# EAGLE design GPduino (EAGLE 6.5.0)
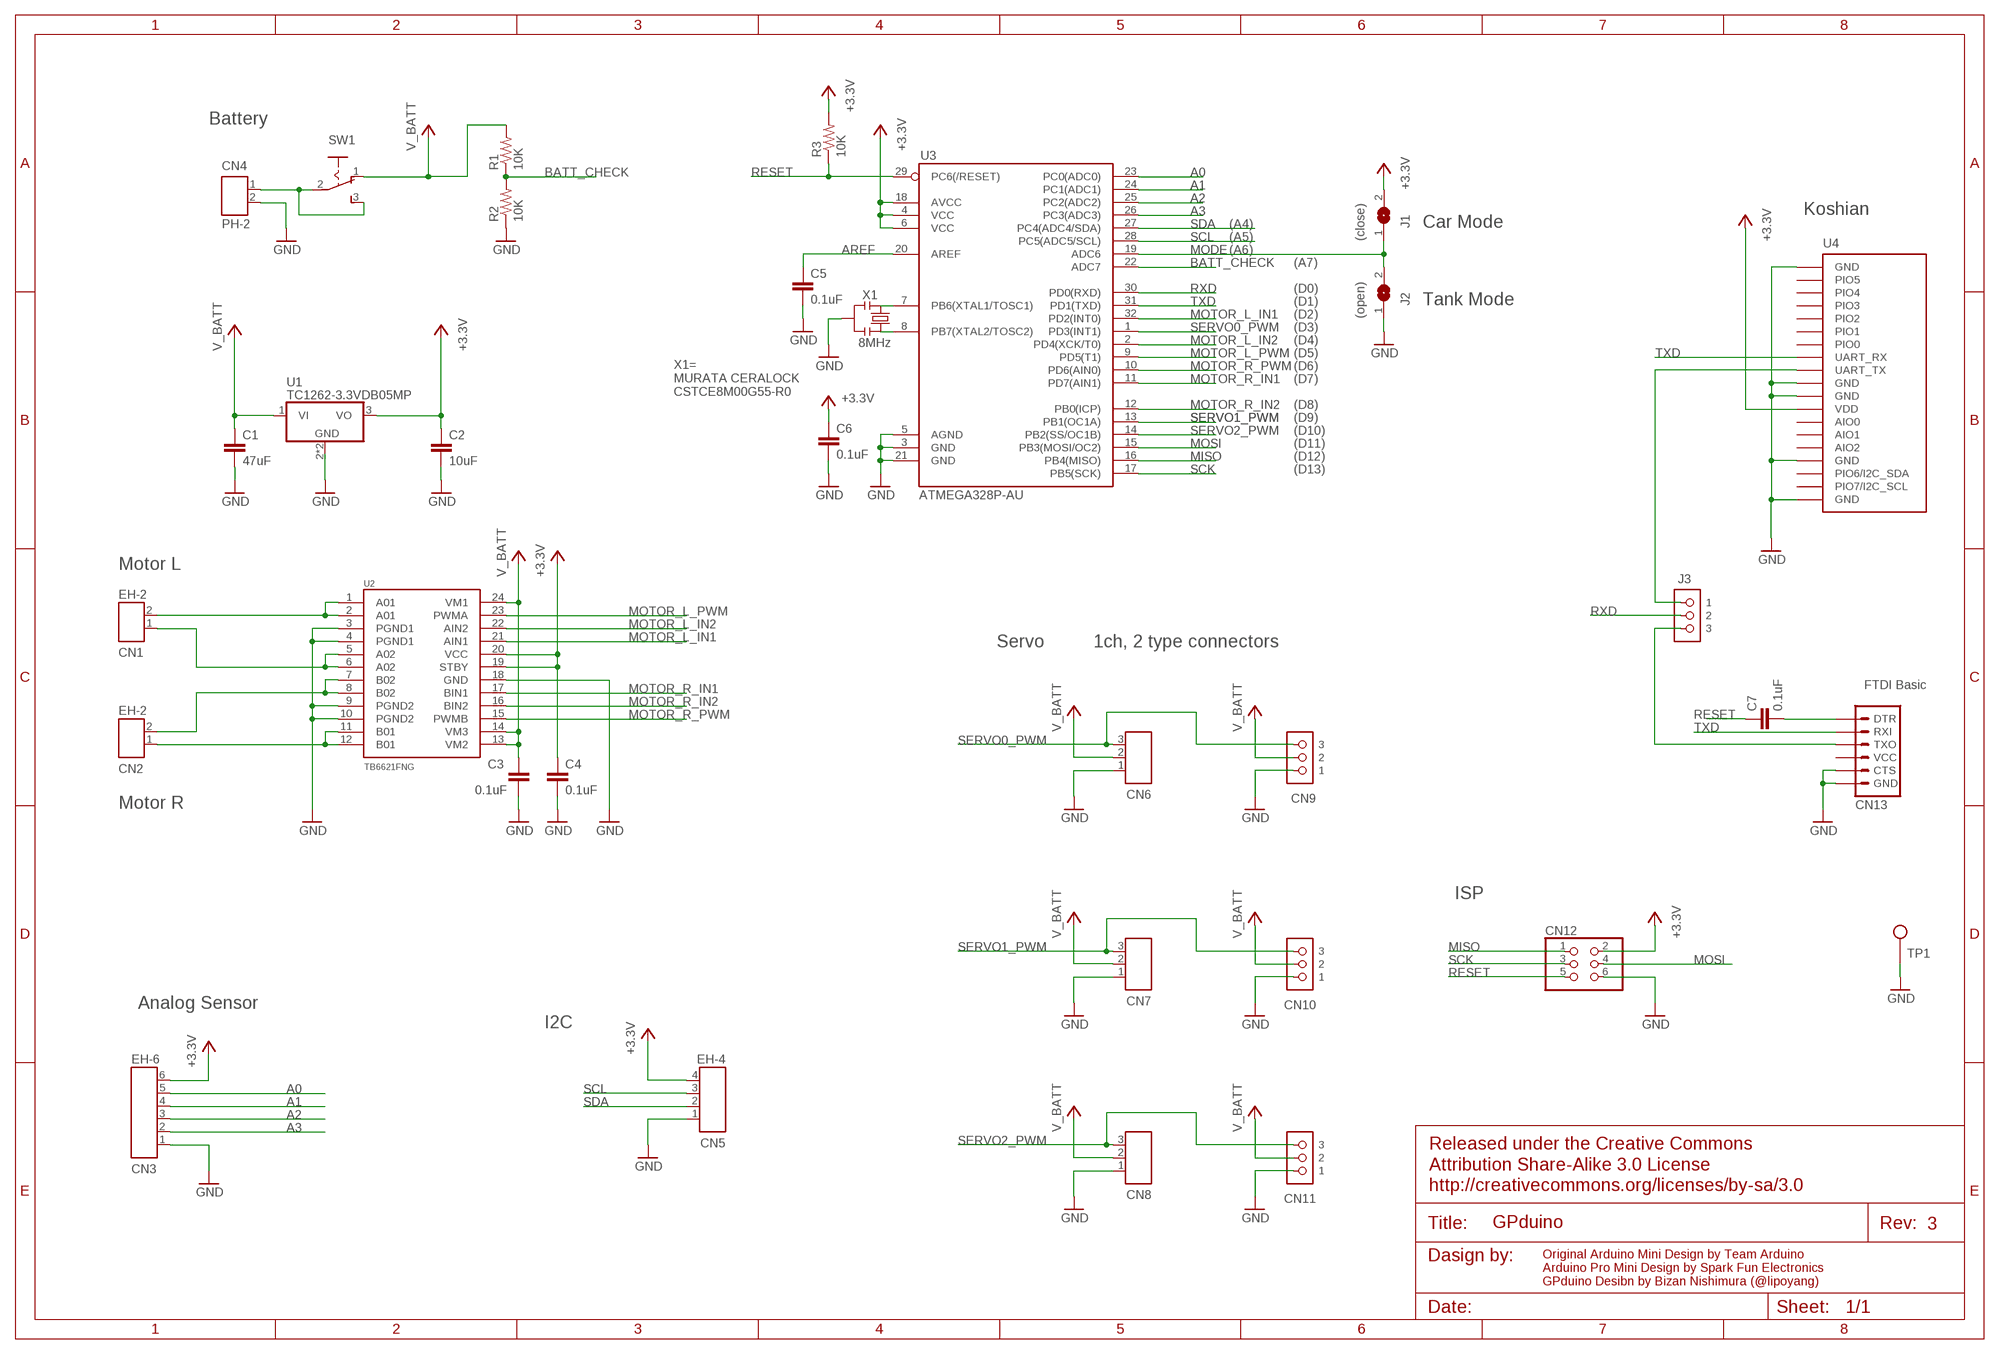
[diagram p0: schematic, sheet 1]

## Parts
C1  47uF  C-EUC3216  [C3216]
C2  10uF  C-EUC3216  [C3216]
C3  0.1uF  C-EUC1608  [C1608]
C4  0.1uF  C-EUC1608  [C1608]
C5  0.1uF  C-EUC1608  [C1608]
C6  0.1uF  C-EUC1608  [C1608]
C7  0.1uF  C-EUC1608  [C1608]
CN1  EH-2  [EH-2]
CN2  EH-2  [EH-2]
CN3  EH-6  [EH-6]
CN4  PH-2  [PH-2]
CN5  EH-4  [EH-4]
CN6  PICOBLADE-3  [PICOBLADE-3]
CN7  PICOBLADE-3  [PICOBLADE-3]
CN8  PICOBLADE-3  [PICOBLADE-3]
CN9  cn6  PINHD-1X3  [CON_RC_SERVO]
CN10  cn6  PINHD-1X3  [CON_RC_SERVO]
CN11  cn6  PINHD-1X3  [CON_RC_SERVO]
CN12  CN9  PINHD-2X3  [2X03]
CN13  FTDI Basic  ARDUINO_SERIAL_PROGRAMPTH  [1X06]
J1  (close)  SJ  [SJ]
J2  (open)  SJ  [SJ]
J3  XX-2  JUMPER_PIN_1X3  [JUMPER_PIN_1X3]
R1  10K  RESISTOR0603-RES  [0603-RES]
R2  10K  RESISTOR0603-RES  [0603-RES]
R3  10K  RESISTOR0603-RES  [0603-RES]
SW1  SW1  M251  [SLIDE-SW]
TP1  TEST_PIN  [TEST_PIN]
U1  TC1262-3.3VDB05MP  [SOT223]
U2  TB6621FNG  [SSOP24]
U3  ATMEGA328P-AU  ATMEGA168  [TQFP32-08]
U4  KOSHIAN  [KOSHIAN]
X1  8MHz  RESONATOR1:1  [RESONATOR-SMD-1:1]

## Nets
+3V3: C2.1 C4.1 C6.1 CN3.6 CN5.4 CN12.2 J1.2 R3.2 U1.3(VO) U2.19(STBY) U2.20(VCC) U3.4(VCC) U3.6(VCC) U3.18(AVCC) U4.12(VDD) ; supply symbol labelled +3.3V
A0: CN3.5 U3.23(PC0(ADC0))
A01: CN1.2 U2.1(A01) U2.2(A01)
A1: CN3.4 U3.24(PC1(ADC1))
A02: CN1.1 U2.5(A02) U2.6(A02)
A2: CN3.3 U3.25(PC2(ADC2))
A3: CN3.2 U3.26(PC3(ADC3))
AREF: C5.1 U3.20(AREF)
BATT_CHECK: R1.1 R2.2 U3.22(ADC7)
GND: C1.2 C2.2 C3.2 C4.2 C5.2 C6.2 CN3.1 CN4.2 CN5.1 CN6.1 CN7.1 CN8.1 CN9.1 CN10.1 CN11.1 CN12.6 CN13.5(CTS) CN13.6(GND) J2.1 R2.1 TP1.1 U1.2(GND) U1.4(GND) U2.3(PGND1) U2.4(PGND1) U2.9(PGND2) U2.10(PGND2) U2.18(GND) U3.3(GND) U3.5(AGND) U3.21(GND) U4.1(GND) U4.10(GND) U4.11(GND) U4.16(GND) U4.16@2(GND) U4.20(GND) X1.2
MISO: CN12.1 U3.16(PB4(MISO))
MODE: J1.1 J2.2 U3.19(ADC6)
MOSI: CN12.4 U3.15(PB3(MOSI/OC2))
MOTOR_L_IN1: U2.21(AIN1) U3.32(PD2(INT0))
MOTOR_L_IN2: U2.22(AIN2) U3.2(PD4(XCK/T0))
MOTOR_L_PWM: U2.23(PWMA) U3.9(PD5(T1))
MOTOR_R_IN1: U2.17(BIN1) U3.11(PD7(AIN1))
MOTOR_R_IN2: U2.16(BIN2) U3.12(PB0(ICP))
MOTOR_R_PWM: U2.15(PWMB) U3.10(PD6(AIN0))
N$1: CN4.1 SW1.2(P) SW1.3(S)
N$3: U3.8(PB7(XTAL2/TOSC2)) X1.3
N$4: U3.7(PB6(XTAL1/TOSC1)) X1.1
N$5: CN2.1 U2.11(B01) U2.12(B01)
N$6: CN2.2 U2.7(B02) U2.8(B02)
N$11: J3.1 U4.9(UART_TX)
N$12: C7.2 CN13.1(DTR)
N$15: CN13.3(TXO) J3.3
RESET: C7.1 CN12.5 R3.1 U3.29(PC6(/RESET))
RXD: J3.2 U3.30(PD0(RXD))
SCK: CN12.3 U3.17(PB5(SCK))
SCL: CN5.3 U3.28(PC5(ADC5/SCL))
SDA: CN5.2 U3.27(PC4(ADC4/SDA))
SERVO0_PWM: CN6.3 CN9.3 U3.1(PD3(INT1))
SERVO1_PWM: CN7.3 CN10.3 U3.13(PB1(OC1A))
SERVO2_PWM: CN8.3 CN11.3 U3.14(PB2(SS/OC1B))
TXD: CN13.2(RXI) U3.31(PD1(TXD)) U4.8(UART_RX) U4.8@2(UART_RX)
V_BATT: C1.1 C3.1 CN6.2 CN7.2 CN8.2 CN9.2 CN10.2 CN11.2 R1.2 SW1.1(O) U1.1(VI) U2.13(VM2) U2.14(VM3) U2.24(VM1)
Unconnected: CN13.4(VCC) U4.2(PIO5) U4.3(PIO4) U4.4(PIO3) U4.5(PIO2) U4.6(PIO1) U4.7(PIO0) U4.13(AIO0) U4.14(AIO1) U4.15(AIO2) U4.17(PIO6/I2C_SDA) U4.18(PIO7/I2C_SCL)

## Notes on the sheet
- Battery
- Koshian
- (A4) | Car Mode
- (A5)
- (A6)
- (A7)
- (D0)
- (D1) | Tank Mode
- (D2)
- (D3)
- (D4)
- (D5)
- (D6)
- (D7)
- X1=
  MURATA CERALOCK
  CSTCE8M00G55-R0
- (D8)
- (D9)
- (D10)
- (D11)
- (D12)
- (D13)
- Motor L
- Servo | 1ch, 2 type connectors
- Motor R
- ISP
- Analog Sensor
- I2C
- 3
- Original Arduino Mini Design by Team Arduino
  Arduino Pro Mini Design by Spark Fun Electronics
  GPduino Desibn by Bizan Nishimura (@lipoyang)

## Library data of the parts
C1-C7 = resistor:C-EU: CAPACITOR, European symbol
CN1 CN2 = lipoyang_mechanical:EH-2
CN3 = lipoyang_mechanical:EH-6
CN4 = lipoyang_mechanical:PH-2
CN5 = lipoyang_mechanical:EH-4
CN6-CN8 = lipoyang_mechanical:PICOBLADE-3
CN9-CN11 = lipoyang_mechanical:PINHD-1X3: PIN HEADER
CN12 = lipoyang_mechanical:PINHD-2X3: PIN HEADER
CN13 = SparkFun:ARDUINO_SERIAL_PROGRAM
J1 J2 = lipoyang:SJ: SMD solder JUMPER
J3 = lipoyang_mechanical:JUMPER_PIN_1X3: JUMPER
R1-R3 = SparkFun:RESISTOR: Resistor Basic schematic elements and footprints for 0603, 1206, and PTH resistors.
SW1 = pendolino:M251: SLIDING SWITCH Mors, distributor Buerklin, 11G702
TP1 = lipoyang:TEST_PIN: Test Pin
U1 = lipoyang:TC1262-3.3VDB: Positive VOLTAGE REGULATOR Source: http://cache.national.com/ds/LM/LM340.pdf
U2 = SparkFun:TB6621FNG: Toshiba 1A motor driver
U3 = SparkFun:ATMEGA168
U4 = lipoyang_rf:KOSHIAN
X1 = Testing:RESONATOR: Resonator Small SMD resonator. This is the itty bitty 10/20MHz resonators with built in caps. CSTCE10M0G55 and CSTCE20M0V53. Footprint for SMD has been used in SFE production for years, and does work okay. 1:1 is an attempt to get larger fillets on the sides so it will be easier to inspect these solders in our AOI machine. The pads have been minimized to match the actual metal under the resonator. To see this relation, it includes an image import of the bottom side of the component. Imported to scale on layer 200.

## Net classes
0 default: width 0.203 mm
1 vcc: width 0.254 mm

## Board
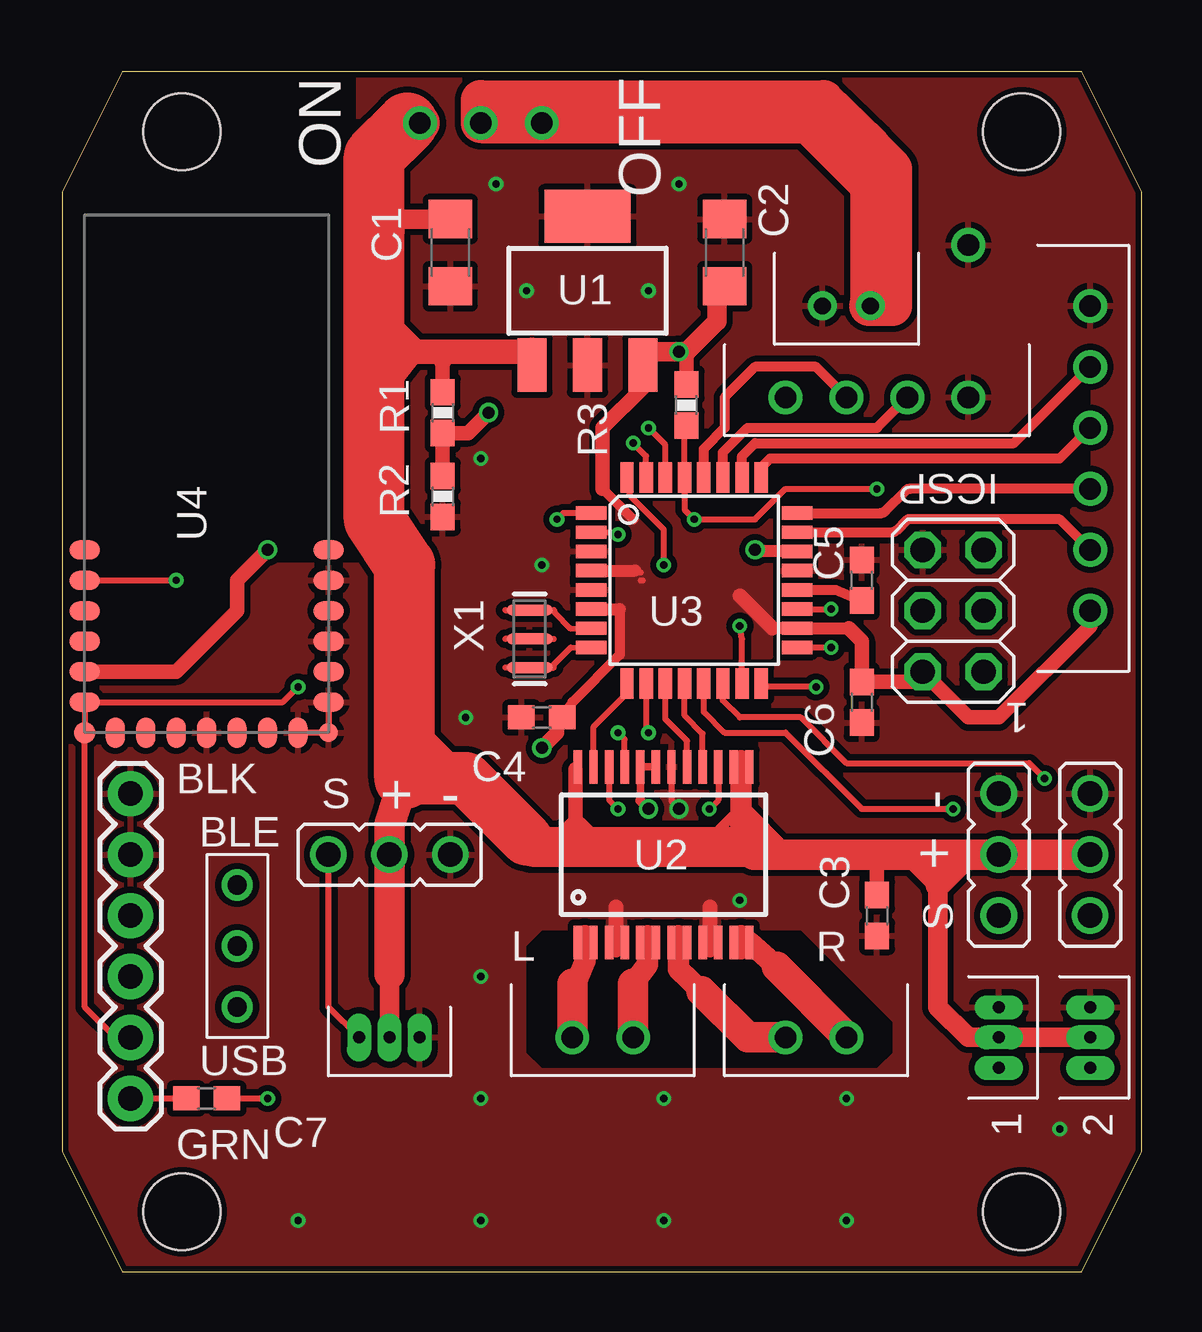
[diagram p1: board, top side]
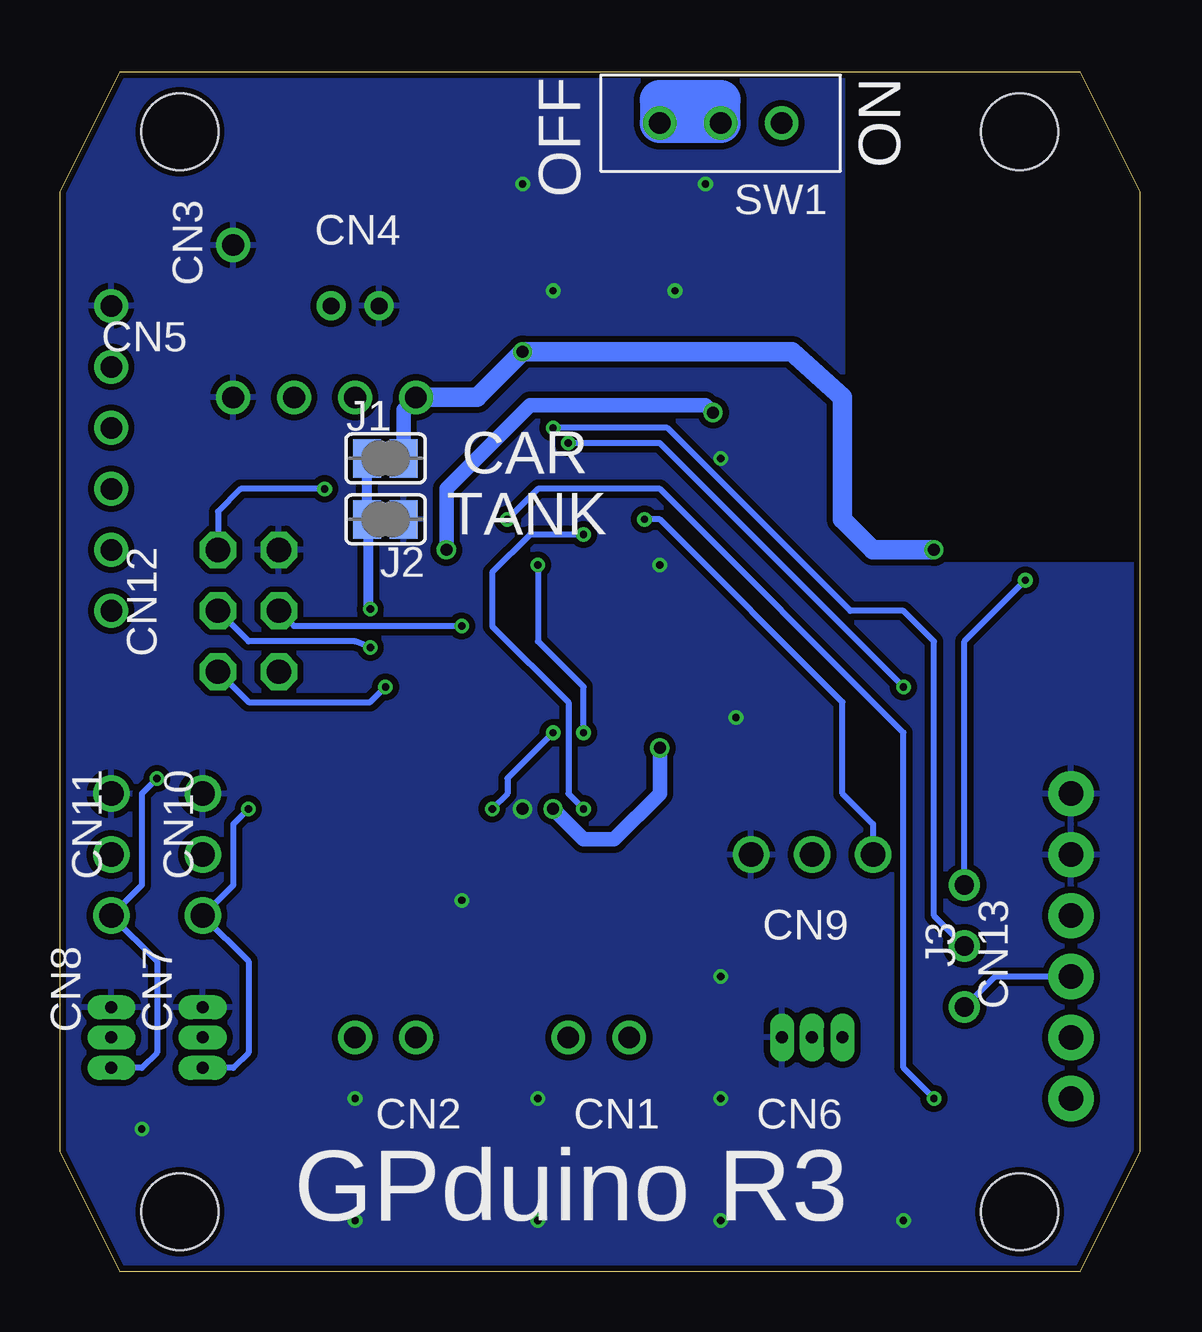
[diagram p2: board, bottom side, seen from below]

Size 45 x 50 mm. Coordinates in mm from the lower left corner, seen from the top.
Outline: 2.5,0 42.5,0 45,5 45,45 42.5,50 2.5,50 0,45 0,5 2.5,0
Copper layers (1*16): Top 0.035mm / dielectric 1.5mm / Bottom 0.035mm
Design rules "SeeedStudio_2layer_DRU_no_angle_20140221_lipoyang": minimum track width 8mil, minimum drill 12mil, track to track 8mil, track to pad 8mil, pad to pad 8mil, via to via 8mil, smd to smd 0mil, copper to edge 10mil, drill to drill 10mil, minimum pad ring 10mil, minimum via ring 6mil, stop-mask expansion 2mil, vias tented up to drill 100mil, thermal gap 10mil
Holes 3.2 mm at 5,47.5 40,47.5 5,2.5 40,2.5

### Footprints (pad centres in the part's own frame; a part is rotated, then mirrored left to right if it is on the bottom)
C3216 = smd 1.6 x 1.8: 1 -1.4,0; 2 1.4,0
C1608 = smd 1.1 x 1: 1 -0.85,0; 2 0.85,0
EH-2 = drill 0.9: 1 -1.27,0; 2 1.27,0
EH-6 = drill 0.9: 1 -6.35,0; 2 -3.81,0; 3 -1.27,0; 4 1.27,0; 5 3.81,0; 6 6.35,0
PH-2 = drill 0.7: 1 -1,0; 2 1,0
EH-4 = drill 0.9: 1 -3.81,0; 2 -1.27,0; 3 1.27,0; 4 3.81,0
PICOBLADE-3 = drill 0.5 long: 1 -1.25,0; 2 0,0; 3 1.27,0
CON_RC_SERVO = drill 1.016: 1 -2.54,0; 2 0,0; 3 2.54,0
2X03 = drill 1.016 octagon: 1 -2.54,-1.27; 2 -2.54,1.27; 3 0,-1.27; 4 0,1.27; 5 2.54,-1.27; 6 2.54,1.27
1X06 = drill 1.016 pad 1.88: 1 0,0; 2 2.54,0; 3 5.08,0; 4 7.62,0; 5 10.16,0; 6 12.7,0
SJ = smd 1.168 x 1.6: 1 -0.762,0; 2 0.762,0
JUMPER_PIN_1X3 = drill 0.8: 1 -2.54,0; 2 0,0; 3 2.54,0
0603-RES = smd 1.1 x 1: 1 -0.85,0; 2 0.85,0
SLIDE-SW = drill 0.9: 1 -2.54,0; 2 0,0; 3 2.54,0
TEST_PIN = drill 0.914: 1 0,0
SOT223 = smd 1.219 x 2.235: 1 -2.311,-3.099; 2 0,-3.099; 3 2.311,-3.099 | smd 3.6 x 2.2: 4 0,3.099
SSOP24 = smd 0.348 x 1.397: 1 -3.575,-3.656; 2 -2.925,-3.656; 3 -2.275,-3.656; 4 -1.625,-3.656; 5 -0.975,-3.656; 6 -0.325,-3.656; 7 0.325,-3.656; 8 0.975,-3.656; 9 1.625,-3.656; 10 2.275,-3.656; 11 2.925,-3.656; 12 3.575,-3.656; 13 3.575,3.656; 14 2.925,3.656; 15 2.275,3.656; 16 1.625,3.656; 17 0.975,3.656; 18 0.325,3.656; 19 -0.325,3.656; 20 -0.975,3.656; 21 -1.625,3.656; 22 -2.275,3.656; 23 -2.925,3.656; 24 -3.575,3.656
TQFP32-08 = smd 1.27 x 0.559: 1 -4.293,2.8; 2 -4.293,2; 3 -4.293,1.2; 4 -4.293,0.4; 5 -4.293,-0.4; 6 -4.293,-1.2; 7 -4.293,-2; 8 -4.293,-2.8; 17 4.293,-2.8; 18 4.293,-2; 19 4.293,-1.2; 20 4.293,-0.4; 21 4.293,0.4; 22 4.293,1.2; 23 4.293,2; 24 4.293,2.8 | smd 0.559 x 1.27: 9 -2.8,-4.293; 10 -2,-4.293; 11 -1.2,-4.293; 12 -0.4,-4.293; 13 0.4,-4.293; 14 1.2,-4.293; 15 2,-4.293; 16 2.8,-4.293; 25 2.8,4.293; 26 2,4.293; 27 1.2,4.293; 28 0.4,4.293; 29 -0.4,4.293; 30 -1.2,4.293; 31 -2,4.293; 32 -2.8,4.293
KOSHIAN = smd 1.27 x 0.8: 1 5.08,5.08; 2 5.08,1.27; 3 5.08,6.35; 4 5.08,3.81; 7 -5.08,2.54; 8 -5.08,0; 9 -5.08,5.08; 11 5.08,2.54; 12 -5.08,1.27; 17 -5.08,6.35; 18 -5.08,3.81; 20 5.08,0 | smd 0.8 x 1.27: 5 2.54,-1.27; 6 -2.54,-1.27; 10 0,-1.27; 13 -3.81,-1.27; 14 -1.27,-1.27; 15 1.27,-1.27; 16 3.81,-1.27 | smd 0.9 x 0.9: 8@2 -5.08,-1.27 | smd 0.8 x 0.8: 16@2 5.08,-1.27
RESONATOR-SMD-1:1 = smd 0.45 x 1.905: 1 -1.2,0; 2 0,0; 3 1.2,0

### Placement (x,y rotation side)
C1  16.19,42.46 270 top
C2  27.62,42.46 90 top
C3  33.97,14.84 270 top
C4  20,23.1 180 top
C5  33.34,28.81 90 top
C6  33.34,23.73 270 top
C7  6.03,7.22 180 top
CN1  22.54,9.76 180 top
CN2  31.43,9.76 180 top
CN3  42.86,33.89 270 top
CN4  32.7,40.24 180 top
CN5  33.97,36.43 180 top
CN6  13.65,9.76 180 top
CN7  39.05,9.76 270 top
CN8  42.86,9.76 270 top
CN9  13.65,17.38 180 top
CN10  39.05,17.38 270 top
CN11  42.86,17.38 270 top
CN12  37.15,27.54 90 top
CN13  2.86,7.22 90 top
J1  31.43,33.89 0 bottom
J2  31.43,31.35 180 bottom
J3  7.3,13.57 270 top
R1  15.87,35.8 90 top
R2  15.87,32.3 90 top
R3  26.03,36.11 90 top
SW1  17.46,47.86 180 bottom
TP1  37.78,42.78 0 top
U1  21.91,40.88 0 top
U2  25.08,17.38 0 top
U3  26.35,28.81 0 top
U4  6.03,23.73 0 top
X1  19.49,26.37 270 top

### Tracks (layer width: path | path; a pad name or v marks a point on that pad's centre or on a via)
+3V3  (via drill 0.5)
  Top 0.254: 27.27,40.45 C2.1 | 23.89,29.21 24.13,29.13 | 35.66,24.58 CN12.2 | 20.63,22.88 C4.1 | 26.03,38.23 v25.71,38.34 | 24.2,28.8 24.13,28.8
  Top 0.305: U2.19 U2.20 24.1,19.62
  Top 0.406: 27.12,40.88 C2.1 | 23.24,27.61 23.24,25.71 21.27,23.73 C4.1 | 24.1,19.62 v24.45,19.29 | 22.54,32.62 23.81,31.35
  Top 0.5: U3.6 23.24,27.61 | 29.62,26.81 U3.18 32.8,26.81 | U3.4 23.89,29.21
  Top 0.61: 29.62,26.81 28.26,28.18 | 32.8,26.81 33.34,26.27 C6.1 35.66,24.58 | U4.12 4.76,25 7.3,27.54 7.3,28.81 v8.57,30.08 | v20,21.83 20.63,22.46 20.63,22.88 | R3.2 26.03,38.23 | CN12.2 37.78,23.1 39.05,23.1 42.86,26.91 CN3.6 | U1.3 24.22,36.84 22.54,35.16 22.54,32.62
  Top 0.813: 27.49,40.75 C2.1 27.3,40.75 27.3,39.61 26.03,38.34 v25.71,38.34 24.2,38.34 U1.3
  Bottom 0.61: v24.45,19.29 23.17,18.02 21.91,18.02 20,19.92 v20,21.83 | J1.2 30.67,35.92 CN5.4
  Bottom 0.813: v8.57,30.08 11.11,30.08 12.38,31.35 12.38,36.43 14.5,38.34 v25.71,38.34 27.62,36.43 CN5.4
  pour Top (isolate 0.254): 23.17,31.98 23.17,25.64 29.52,25.64 29.52,31.98
A0
  Top 0.406: CN3.5 41.59,31.35 35.24,31.35 34.77,30.88 arc-45 34.59,30.81 U3.23
A01
  Top 0.254: U2.1 21.8,14 U2.2
  Top 0.406: 21.51,12.23 21.27,12
  Top 0.9: 21.8,14 21.8,12.93 21.51,12.23
  Top 1.27: 21.27,12 CN1.2
A1
  Top 0.406: CN3.4 35.34,32.62 arc45 35.17,32.55 34.3,31.68 arc-45 34.12,31.61 U3.24
A02
  Top 0.254: U2.5 24.4,14 U2.6
  Top 0.9: 24.4,14 24.4,12.8 23.81,12
  Top 1.27: 23.81,12 CN1.1
A2
  Top 0.406: U3.25 29.15,33.52 29.52,33.89 41.59,33.89 CN3.3
A3
  Top 0.406: U3.26 28.35,33.98 28.89,34.52 39.69,34.52 CN3.2
AREF
  Top 0.406: U3.20 32.25,28.41 C5.1
BATT_CHECK  (via drill 0.5)
  Top 0.254: 28.96,30.01 v28.89,30.08
  Top 0.5: U3.22 28.96,30.01
  Top 0.61: R2.2 R1.1 16.93,34.95 v17.78,35.8
  Bottom 0.61: v17.78,35.8 18.09,36.11 25.4,36.11 28.89,32.62 v28.89,30.08
GND  (via drill 0.3, 0.5)
  Top 0.254: U2.18 25.41,19.6 v25.71,19.29 | U2.3 23.1,13.4 | U2.9 27,13.4 | U4.20 U4.16@2 U4.16
  Top 0.406: 20.51,44.04 21.68,44.04 | 21.68,44.04 22.31,43.97 | 21.68,44.04 20.41,44.23 | CN6.1 14.92,9.76 | 21.27,43.27 21.2,43.34 | 27.31,43.87 C2.2 27.62,43.41
  Top 0.61: 23.1,13.4 23.1,15.2 | 27,13.4 27,15.2
  Top 0.813: 22.31,43.97 U1.4 20.84,43.55 | 20.51,44.04 21.2,43.34
  other vias: 9.84,2.14 17.46,2.14 25.08,2.14 32.7,2.14 17.46,7.22 25.08,7.22 32.7,7.22 41.59,5.95 17.46,12.3 25.71,45.32 16.83,23.1 20,29.45 28.26,15.47 17.46,33.89 24.45,40.88 19.37,40.88 18.09,45.32
  pour Top (isolate 0.254, rank 2): -0.32,29.45 12.38,29.45 12.38,50.4 45.4,50.4 45.4,-0.4 -0.32,-0.4
  pour Bottom (isolate 0.254): -0.96,29.45 11.11,29.45 12.38,30.71 12.38,51.04 46.04,51.04 46.04,-0.4 -0.96,-0.4
MISO  (via drill 0.3)
  Top 0.254: v31.43,24.37 29.3,24.37 U3.16
  Bottom 0.254: CN12.1 37.15,23.73 32.07,23.73 v31.43,24.37
MODE  (via drill 0.3)
  Top 0.254: U3.19 v32.07,27.61
  Bottom 0.254: v32.07,27.61 32.13,27.61
  Bottom 0.406: J2.2 J1.1 | 32.13,27.61 32.13,31.21
  Bottom 0.61: 32.13,31.21 arc-45 J2.2
MOSI  (via drill 0.3)
  Top 0.254: U3.15 28.35,26.37 v28.26,26.91
  Bottom 0.254: v28.26,26.91 35.24,26.91 CN12.4
MOTOR_L_IN1  (via drill 0.3)
  Top 0.254: U2.21 23.45,22.18 v23.17,22.46 | U3.32 23.6,32.6 23.65,32.55 23.65,32.36 25.08,30.93 v25.08,29.45
  Bottom 0.254: v23.17,22.46 23.17,24.37 25.08,26.27 v25.08,29.45
MOTOR_L_IN2  (via drill 0.3)
  Top 0.254: U3.2 23.08,30.81 v23.17,30.71 | U2.22 22.8,19.66 v23.17,19.29
  Bottom 0.254: v23.17,30.71 25.41,30.71 26.98,29.15 26.98,26.91 23.81,23.73 23.81,19.92 v23.17,19.29
MOTOR_L_PWM
  Top 0.254: U2.23 22.16,22.71 23.55,24.11 U3.9
MOTOR_R_IN1
  Top 0.254: U2.17 26.05,22.12 25.15,23.03 U3.11
MOTOR_R_IN2
  Top 0.254: U2.16 26.7,22.42 25.95,23.18 U3.12
MOTOR_R_PWM  (via drill 0.3)
  Top 0.254: U2.15 27.36,19.66 v26.98,19.29 | U3.10 24.35,22.55 v24.45,22.46
  Bottom 0.254: v24.45,22.46 26.35,20.55 26.35,19.92 v26.98,19.29
N$1
  Top 0.203: 33.7,42.78 34.61,42.78
  Top 1.676: 30.8,47.86 SW1.3 SW1.2 17.46,48.81 31.75,48.81 | 33.7,46.91 31.75,48.81 | 31.75,48.81 30.8,47.86 | 30.8,47.86 31.11,47.86 33.7,45.27 33.7,42.78 CN4.1 | 33.65,40.24 34.61,40.24 34.61,42.78 34.61,45.95 33.65,46.91
  Bottom 1.676: SW1.2 SW1.3 20,48.81 17.46,48.81 SW1.2
N$2
  cutout Top: 19.37,9.12 20,8.49 33.97,8.49 34.61,9.12 34.61,10.39 30.8,14.21 20,14.21 19.37,13.57
N$3
  Top 0.254: 20.51,25.17 20.51,25.31 21.2,26 U3.8
N$4
  Top 0.254: 20.51,27.57 20.53,27.47 21.2,26.8 U3.7
N$5
  Top 0.254: U2.12 28.3,14 | 28.3,13.45 U2.11
  Top 0.9: 28.3,14 28.3,13.45 | 29.8,12.7 U2.12
  Top 1.27: CN2.1 32.7,9.8 29.8,12.7
N$6
  Top 0.254: U2.7 25.7,14 U2.8
  Top 0.9: 25.7,14 25.7,12.6 26.66,11.7
  Top 1.27: 26.66,11.7 28.59,9.76 CN2.2
N$7
  cutout Top: 42.86,37.7 42.86,32.62 41.59,31.35 30.8,31.35 29.52,32.62 28.26,32.62 28.26,33.89 28.89,34.52 39.69,34.52
N$11  (via drill 0.3)
  Top 0.254: U4.9 v4.76,28.81
  Bottom 0.254: v4.76,28.81 7.3,26.27 J3.1
N$12
  Top 0.254: CN13.1 C7.2
N$15
  Bottom 0.254: CN13.3 6.03,12.3 J3.3
RESET  (via drill 0.3)
  Top 0.254: R3.1 25.95,35.18 U3.29 25.95,31.75 v26.35,31.35 28.89,31.35 30.16,32.62 v33.97,32.62 | C7.1 v8.57,7.22
  Bottom 0.254: v33.97,32.62 37.46,32.62 38.41,31.67 CN12.5 | v26.35,31.35 25.08,32.62 20,32.62 9.84,22.46 9.84,8.49 v8.57,7.22
RXD  (via drill 0.3)
  Top 0.254: U3.30 25.15,34.45 v24.45,35.16
  Bottom 0.254: v24.45,35.16 19.68,35.16 12.06,27.54 9.84,27.54 8.57,26.27 8.57,14.84 J3.2
SCK  (via drill 0.3)
  Top 0.254: U3.17 v32.07,26.01
  Bottom 0.254: v32.07,26.01 32.7,26.27 37.15,26.27 CN12.3
SCL
  Top 0.406: U3.28 26.75,34.29 27.62,35.16 27.62,36.43 28.89,37.7 31.43,37.7 CN5.3
SDA
  Top 0.406: U3.27 27.55,34.14 28.57,35.16 33.97,35.16 CN5.2
SERVO0_PWM  (via drill 0.3)
  Top 0.254: CN6.3 11.11,11.03 CN9.3 | v20.63,31.35 20.9,31.61 U3.1
  Bottom 0.254: v20.63,31.35 20,31.35 12.38,23.73 12.38,19.92 11.11,18.65 CN9.3
SERVO1_PWM  (via drill 0.3)
  Top 0.254: U3.13 26.75,23.33 27.62,22.46 30.16,22.46 33.34,19.29 v37.15,19.29
  Bottom 0.254: v37.15,19.29 37.78,18.65 37.78,16.11 CN10.3 37.15,12.94 37.15,9.12 37.78,8.49 CN7.3
SERVO2_PWM  (via drill 0.3)
  Top 0.254: U3.14 27.55,23.8 28.26,23.1 30.8,23.1 32.7,21.19 40.32,21.19 v40.95,20.55
  Bottom 0.254: v40.95,20.55 41.59,19.92 41.59,16.11 CN11.3 40.95,12.94 40.95,9.12 41.59,8.49 CN8.3
TXD  (via drill 0.3)
  Top 0.254: v9.84,24.37 9.21,23.73 U4.8 U4.8@2 0.95,11.03 2.22,9.76 CN13.2 | 24.35,32.72 U3.31 24.35,33.98 v23.81,34.52
  Bottom 0.254: v9.84,24.37 20,34.52 v23.81,34.52
V_BATT
  Top 0.254: U2.14 28.01,21.11 28.3,21.4 28.3,21.29 U2.13 | 28.3,18.21 28.5,17.71 | U2.24 21.4,20.94
  Top 0.406: 26.98,18.02 28.26,19.29
  Top 0.61: 21.4,20.94 21.4,18.65 | 21.4,18.65 21.4,18.4 19.6,17.71 | 20.95,18.33 21.27,18.65 21.4,18.65 | 21.4,18.65 21.59,18.65 21.91,18.33 | 13.15,43.86 13.01,43.41 | 13.8,39.54 14.9,38.44 13.8,37.02 13.62,36.7 13.01,37.3 | 15,22.5 16.4,21.1 16.4,20.66 16.5,20.55 | R1.2 15.87,38.02 | C3.1 33.97,17.38
  Top 0.813: 13.65,12.4 CN6.2 | C1.1 13.15,43.86 | 15.87,38.02 15.55,38.34 | 28.26,19.29 30.16,17.38 | CN8.2 CN7.2 37.78,9.76 36.51,11.03 36.51,16.11 35.24,17.38
  Top 0.9: 28.3,21.29 28.3,18.21
  Top 1.016: U1.1 19.59,38.42 19.05,38.34 15.55,38.34 13.65,38.34 13.41,38.41 13.01,37.7 | 36.51,16.11 37.78,17.38
  Top 1.27: 13.65,12.4 CN9.2 13.65,18.65 14.28,20.55 | CN11.2 CN10.2 37.78,17.38 35.24,17.38 33.97,17.38 30.16,17.38 28.84,17.38 28.5,17.71
  Top 1.676: SW1.1 14.4,47.86 14.28,47.86 | 19.37,18.02 19.6,17.71 21.4,17.7 28.5,17.71
  Top 2.184: 14.28,20.55 16.5,20.55 16.83,20.55 19.37,18.02
  Top 2.54: 14.28,20.55 14.28,29.45 13.01,31.35 13.01,37.3 13.01,37.7 13.01,43.41 13.01,46.48 14.4,47.86

### Text on the board
tPlace: ON | OFF | ICSP | 1 | BLK | S | - | + | - | BLE | + | S | L | R | USB | 1 | 2 | GRN
bPlace: ON | OFF | CAR | TANK | GPduino R3